# Altium schematic sheet [12] - CONNECTORS.SchDoc: CONNECTORS
size A4; Organization: Bjørn T. Brodtkorb; Address1: Frode Rinnans veg 161; Address2: 7050 Trondheim; DocumentNumber: 13; Revision: 1.0; SheetNumber: 13; SheetTotal: 13
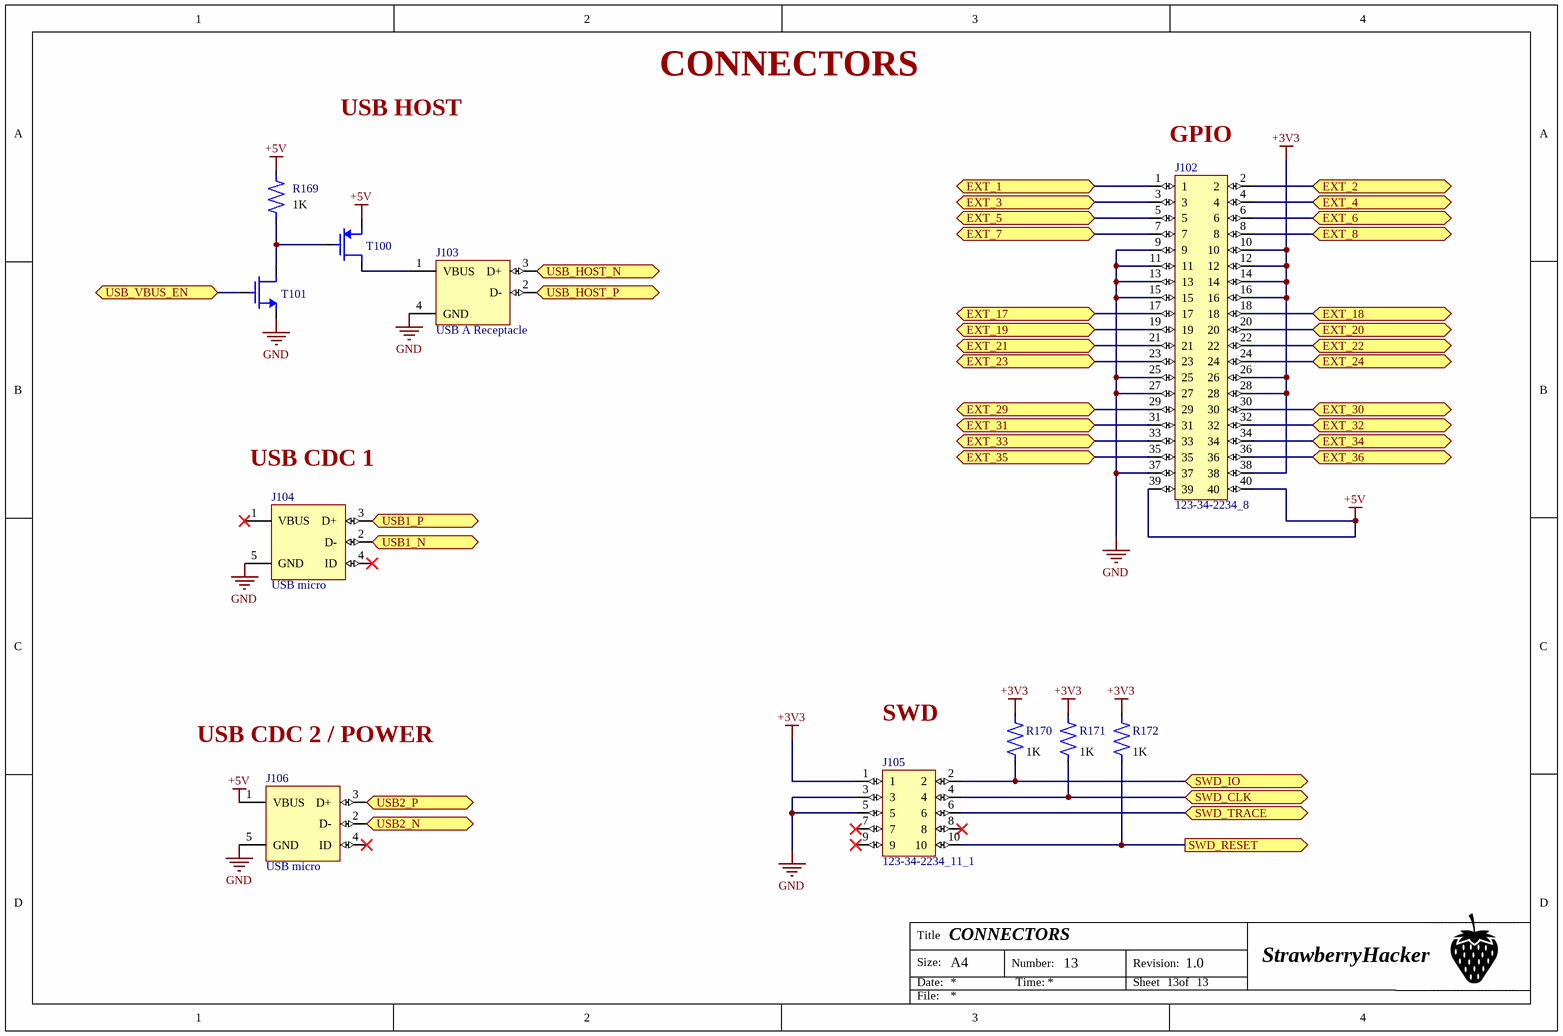
[diagram p0: [12] - CONNECTORS.SchDoc]

## Parts
J102  123-34-2234_8  [Header 2x20 male]
J103  USB A Receptacle  [USB A Right angle]
J104  USB micro  [USB micro]
J105  123-34-2234_11_1  [Header 2x5 male 1.27mm]
J106  USB micro  [USB micro]
R169  value 1K  [R0603]  (hidden comment: CPF-A-0603B100KE1)
R170  value 1K  [R0402]  (hidden comment: CRCW04020000Z0ED)
R171  value 1K  [R0402]  (hidden comment: CRCW04020000Z0ED)
R172  value 1K  [R0402]  (hidden comment: CRCW04020000Z0ED)
T100  DMP1045U  [DMP1045U]  (value not drawn)
T101  DMG6968U  [DMG6968U]  (value not drawn)

## Ports
EXT_1 (bidir), EXT_2 (bidir), EXT_3 (bidir), EXT_4 (bidir), EXT_5 (bidir), EXT_6 (bidir), EXT_7 (bidir), EXT_8 (bidir), EXT_17 (bidir), EXT_18 (bidir), EXT_19 (bidir), EXT_20 (bidir), EXT_21 (bidir), EXT_22 (bidir), EXT_23 (bidir), EXT_24 (bidir), EXT_29 (bidir), EXT_30 (bidir), EXT_31 (bidir), EXT_32 (bidir), EXT_33 (bidir), EXT_34 (bidir), EXT_35 (bidir), EXT_36 (bidir), SWD_CLK (bidir), SWD_IO (bidir), SWD_RESET (out), SWD_TRACE (bidir), USB1_N (bidir), USB1_P (bidir), USB2_N (bidir), USB2_P (bidir), USB_HOST_N (bidir), USB_HOST_P (bidir), USB_VBUS_EN (bidir)

## Nets
+3V3: J102.10 J102.12 J102.14 J102.16 J102.26 J102.28 J102.38 J105.1 R170.2 R171.2 R172.2
+5V: J102.39 J102.40 J106.1(VBUS) R169.2 T100.2(S)
GND: J102.9 J102.11 J102.13 J102.15 J102.25 J102.27 J102.37 J103.4(GND) J104.5(GND) J105.3 J105.5 J106.5(GND) T101.2(S)
EXT_1: J102.1 ; port EXT_1
EXT_2: J102.2 ; port EXT_2
EXT_3: J102.3 ; port EXT_3
EXT_4: J102.4 ; port EXT_4
EXT_5: J102.5 ; port EXT_5
EXT_6: J102.6 ; port EXT_6
EXT_7: J102.7 ; port EXT_7
EXT_8: J102.8 ; port EXT_8
EXT_17: J102.17 ; port EXT_17
EXT_18: J102.18 ; port EXT_18
EXT_19: J102.19 ; port EXT_19
EXT_20: J102.20 ; port EXT_20
EXT_21: J102.21 ; port EXT_21
EXT_22: J102.22 ; port EXT_22
EXT_23: J102.23 ; port EXT_23
EXT_24: J102.24 ; port EXT_24
EXT_29: J102.29 ; port EXT_29
EXT_30: J102.30 ; port EXT_30
EXT_31: J102.31 ; port EXT_31
EXT_32: J102.32 ; port EXT_32
EXT_33: J102.33 ; port EXT_33
EXT_34: J102.34 ; port EXT_34
EXT_35: J102.35 ; port EXT_35
EXT_36: J102.36 ; port EXT_36
SWD_CLK: J105.4 R171.1 ; port SWD_CLK
SWD_IO: J105.2 R170.1 ; port SWD_IO
SWD_RESET: J105.10 R172.1 ; port SWD_RESET
SWD_TRACE: J105.6 ; port SWD_TRACE
USB1_N: J104.2(D-) ; port USB1_N
USB1_P: J104.3(D+) ; port USB1_P
USB2_N: J106.2(D-) ; port USB2_N
USB2_P: J106.3(D+) ; port USB2_P
USB_HOST_N: J103.3(D+) ; port USB_HOST_N
USB_HOST_P: J103.2(D-) ; port USB_HOST_P
USB_VBUS_EN: T101.1(G) ; port USB_VBUS_EN
NetJ103_1: J103.1(VBUS) T100.3(D)
NetR169_1: R169.1 T100.1(G) T101.3(D)

Not connected (* = marked no-connect by the designer): J104 1(VBUS)* 4(ID)*; J105 7* 8* 9*; J106 4(ID)*

## Notes on the sheet
- CONNECTORS
- USB HOST
- (near J102) GPIO
- (near J104) USB CDC 1
- (near J106) USB CDC 2 / POWER
- (near J105) SWD
- Title
- Size:
- Date:
- A4
- Number:
- Time:
- Revision:
- Sheet
- of
- StrawberryHacker
- File:

## Library data of the parts
J102 = 123-34-2234_8: Header 2x20 male 2.54mm
J103 = MC32593_1: USB A Right angle; Supplier Part Number 1: 1696534; Supplier 1: Farnell
J104 J106 = 47590-0001: USB B micro; Supplier Part Number 1: 1568022; Supplier 1: Farnell
J105 = 123-34-2234_11_1: Header 2x5 male 1.27mm
R169 = CPF-A-0603B100KE1: R0603
R170-R172 = CRCW04020000Z0ED: R0402
T100 = DMP1045U: PMOS 5.2A -550mV; Threshold voltage: -550mV; Cont. drain current: 5.2A; Supplier Part Number 1: 2061526; Supplier 1: Farnell
T101 = DMG6968U: NMOS 6.5A 500mV; Threshold voltage: 500mV; Cont. drain current: 6.5A; Supplier Part Number 1: 1843757; Supplier 1: Farnell